# Altium schematic sheet main.SchDoc: Project SHED
size A4; DrawnBy: ultralyj; DocumentNumber: 1; Revision: 0.1; SheetNumber: 1; SheetTotal: 2
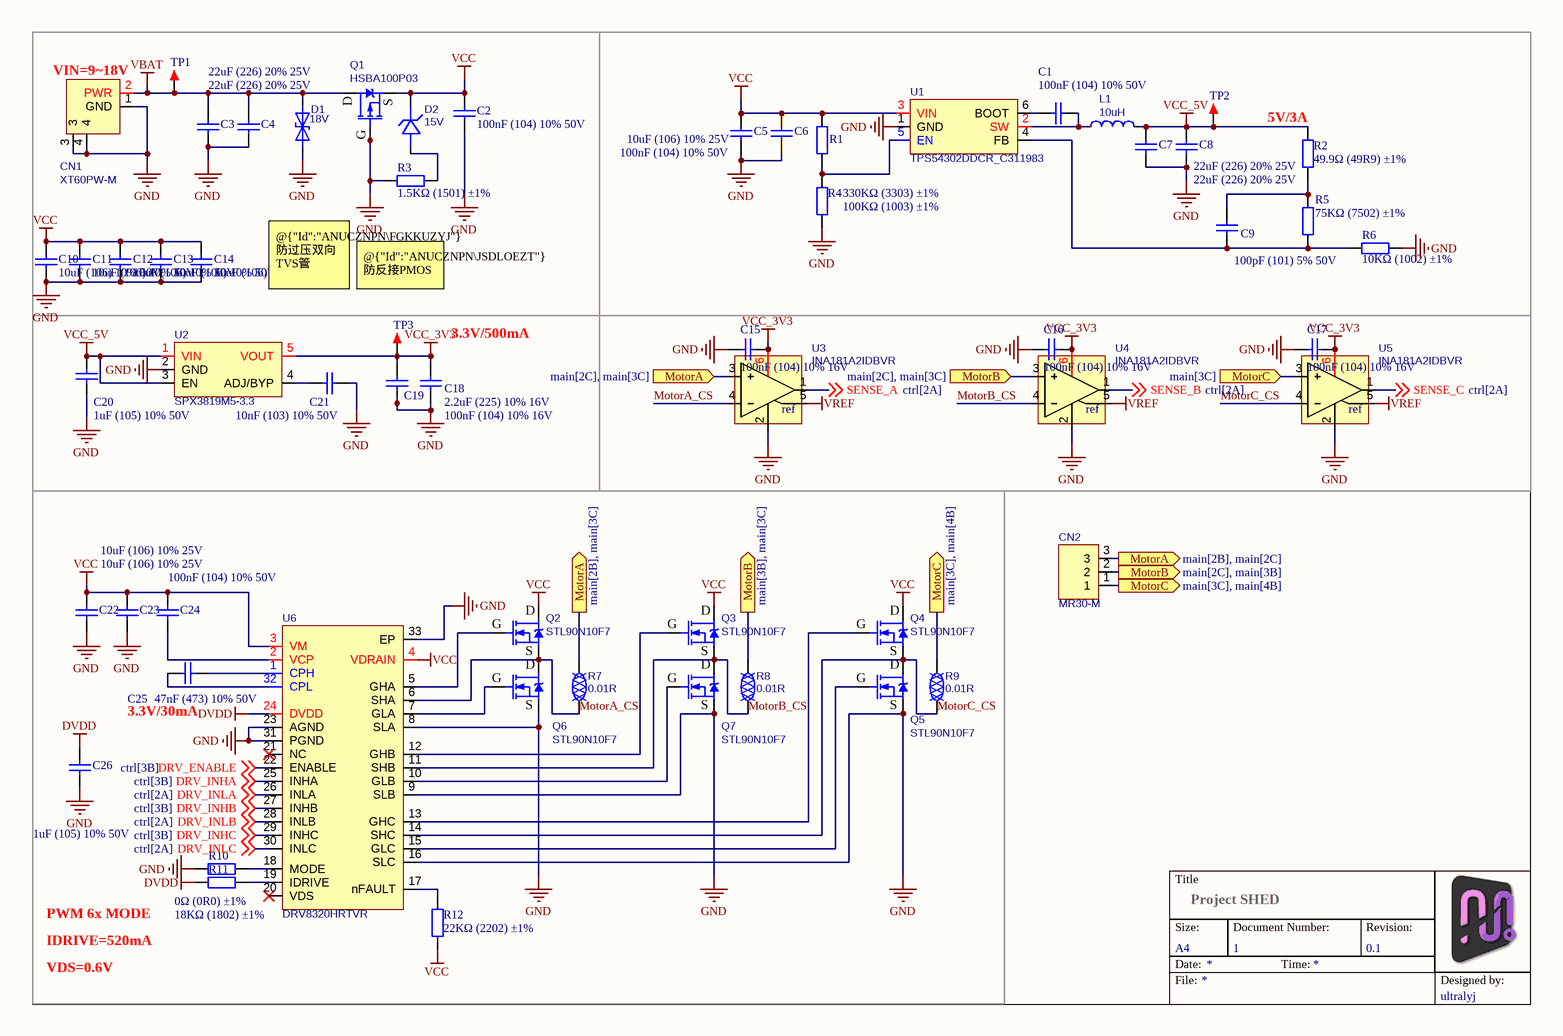
[diagram p0: main.SchDoc]

## Parts
C1  100nF (104) 10% 50V  [LC-0603_C_NOSILK]
C2  100nF (104) 10% 50V  [LC-0603_C_NOSILK]
C3  22uF (226) 20% 25V  [LC-0805_C_NOSILK]
C4  22uF (226) 20% 25V  [LC-0805_C_NOSILK]
C5  10uF (106) 10% 25V  [LC-0805_C_NOSILK]
C6  100nF (104) 10% 50V  [LC-0603_C_NOSILK]
C7  22uF (226) 20% 25V  [LC-0805_C_NOSILK]
C8  22uF (226) 20% 25V  [LC-0805_C_NOSILK]
C9  100pF (101) 5% 50V  [LC-0402_C_NOSILK]
C10  10uF (106) 10% 50V  [1206_C]
C11  10uF (106) 10% 50V  [1206_C]
C12  10uF (106) 10% 50V  [1206_C]
C13  10uF (106) 10% 50V  [1206_C]
C14  10uF (106) 10% 50V  [1206_C]
C15  100nF (104) 10% 16V  [LC-0402_C_NOSILK]
C16  100nF (104) 10% 16V  [LC-0402_C_NOSILK]
C17  100nF (104) 10% 16V  [LC-0402_C_NOSILK]
C18  2.2uF (225) 10% 16V  [LC-0603_C_NOSILK]
C19  100nF (104) 10% 16V  [LC-0402_C_NOSILK]
C20  1uF (105) 10% 50V  [LC-0603_C_NOSILK]
C21  10nF (103) 10% 50V  [LC-0402_C_NOSILK]
C22  10uF (106) 10% 25V  [LC-0805_C_NOSILK]
C23  10uF (106) 10% 25V  [LC-0805_C_NOSILK]
C24  100nF (104) 10% 50V  [LC-0603_C_NOSILK]
C25  47nF (473) 10% 50V  [LC-0603_C_NOSILK]
C26  1uF (105) 10% 50V  [LC-0603_C_NOSILK]
CN1  XT60PW-M  [CONN-TH_XT60PW-M]
CN2  MR30-M  [AMASS-MR30-M]
D1  18V  [SMB_L4.6-W3.6-LS5.3-BI]
D2  15V  [SOD-323_L1.8-W1.3-LS2.5-RD]
L1  10uH  [IND-SMD_L5.4-W5.2]
Q1  HSBA100P03  [DFN-8_L5.7-W5.1-P1.27-LS6.1-BL]
Q2  STL90N10F7  [POWERFLAT-8_L5.2-W6.0-P1.27-LS6.2-BL]
Q3  STL90N10F7  [POWERFLAT-8_L5.2-W6.0-P1.27-LS6.2-BL]
Q4  STL90N10F7  [POWERFLAT-8_L5.2-W6.0-P1.27-LS6.2-BL]
Q5  STL90N10F7  [POWERFLAT-8_L5.2-W6.0-P1.27-LS6.2-BL]
Q6  STL90N10F7  [POWERFLAT-8_L5.2-W6.0-P1.27-LS6.2-BL]
Q7  STL90N10F7  [POWERFLAT-8_L5.2-W6.0-P1.27-LS6.2-BL]
R1  330KΩ (3303) ±1%  [LC-0402_R_NOSILK]
R2  49.9Ω (49R9) ±1%  [LC-0402_R_NOSILK]
R3  1.5KΩ (1501) ±1%  [LC-0402_R_NOSILK]
R4  100KΩ (1003) ±1%  [LC-0402_R_NOSILK]
R5  75KΩ (7502) ±1%  [LC-0402_R_NOSILK]
R6  10KΩ (1002) ±1%  [LC-0402_R_NOSILK]
R7  0.01R  [RES-SMD_L6.4-W3.2_RLP25]
R8  0.01R  [RES-SMD_L6.4-W3.2_RLP25]
R9  0.01R  [RES-SMD_L6.4-W3.2_RLP25]
R10  0Ω (0R0) ±1%  [LC-0402_R_NOSILK]
R11  18KΩ (1802) ±1%  [LC-0402_R_NOSILK]
R12  22KΩ (2202) ±1%  [LC-0402_R_NOSILK]
TP1  TEST  [TEST 1.6]  (value not drawn)
TP2  TEST  [TEST 1.6]  (value not drawn)
TP3  TEST  [TEST 1.6]  (value not drawn)
U1  TPS54302DDCR_C311983  [SOT-23-6_L2.9-W1.6-P0.95-LS2.8-BL]
U2  SPX3819M5-3.3  [SOT-23-5_L2.9-W1.6-P0.95-LS2.8-BL]
U3  INA181A2IDBVR  [SOT-23-6_L2.9-W1.6-P0.95-LS2.8-BL]
U4  INA181A2IDBVR  [SOT-23-6_L2.9-W1.6-P0.95-LS2.8-BL]
U5  INA181A2IDBVR  [SOT-23-6_L2.9-W1.6-P0.95-LS2.8-BL]
U6  DRV8320HRTVR  [QFN-32_L5.0-W5.0-P0.50-TL-EP3.5]

## Blocks framed on the sheet
VIN=9~18V: C2-C4 C10-C14 CN1 D1 D2 Q1 R3 TP1
5V/3A: C1 C5-C9 L1 R1 R2 R4-R6 TP2 U1
3.3V/500mA: C18-C21 TP3 U2

## Ports
MotorA (in, see main[2C], main[3C]), MotorA (out, see main[2B], main[2C]), MotorA (out, see main[2B], main[3C]), MotorB (in, see main[2C], main[3C]), MotorB (out, see main[2C], main[3B]), MotorB (out, see main[3B], main[3C]), MotorC (in, see main[3C]), MotorC (out, see main[3C], main[4B])

## Nets
DVDD: C26.2 R11.1 U6.24(DVDD)
GND: C2.1 C3.1 C4.1 C5.1 C6.1 C7.1 C8.1 C10.1 C11.1 C12.1 C13.1 C14.1 C15.1 C16.1 C17.1 C18.1 C19.1 C20.1 C21.2 C22.1 C23.1 C26.1 CN1.1(GND) CN1.3 CN1.4 D1.1 Q1.4(G) Q5.1,2,3(S) Q6.1,2,3(S) Q7.1,2,3(S) R3.1 R4.1 R6.1 R10.1 U1.1(GND) U2.2(GND) U3.2(GND) U4.2(GND) U5.2(GND) U6.8(SLA) U6.9(SLB) U6.16(SLC) U6.23(AGND) U6.31(PGND) U6.33(EP)
VBAT: C3.2 C4.2 CN1.2(PWR) D1.2 Q1.5,6,7,8,9(D) TP1.1
VCC: C2.2 C5.2 C6.2 C10.2 C11.2 C12.2 C13.2 C14.2 C22.2 C23.2 C24.2 D2.1 Q1.1,2,3(S) Q2.5,6,7,8(D) Q3.5,6,7,8(D) Q4.5,6,7,8(D) R1.2 R12.2 U1.3(VIN) U6.3(VM) U6.4(VDRAIN)
VCC_3V3: C15.2 C16.2 C17.2 C18.2 C19.2 TP3.1 U2.5(VOUT) U3.6(VS) U4.6(VS) U5.6(VS)
VCC_5V: C7.2 C8.2 C20.2 L1.2 R2.2 TP2.1 U2.1(VIN) U2.3(EN)
VREF: U3.5(REF) U4.5(REF) U5.5(REF)
DRV_ENABLE: U6.22(ENABLE) ; off-sheet DRV_ENABLE
DRV_INHA: U6.25(INHA) ; off-sheet DRV_INHA
DRV_INHB: U6.27(INHB) ; off-sheet DRV_INHB
DRV_INHC: U6.29(INHC) ; off-sheet DRV_INHC
DRV_INLA: U6.26(INLA) ; off-sheet DRV_INLA
DRV_INLB: U6.28(INLB) ; off-sheet DRV_INLB
DRV_INLC: U6.30(INLC) ; off-sheet DRV_INLC
MotorA: CN2.3 R7.2 U3.3(IN+) ; port MotorA
MotorA_CS: Q2.1,2,3(S) Q6.5,6,7,8(D) R7.1 U3.4(IN-) U6.6(SHA)
MotorB: CN2.2 R8.2 U4.3(IN+) ; port MotorB
MotorB_CS: Q3.1,2,3(S) Q7.5,6,7,8(D) R8.1 U4.4(IN-) U6.11(SHB)
MotorC: CN2.1 R9.1 U5.3(IN+) ; port MotorC
MotorC_CS: Q4.1,2,3(S) Q5.5,6,7,8(D) R9.2 U5.4(IN-) U6.14(SHC)
SENSE_A: U3.1(OUT) ; off-sheet SENSE_A
SENSE_B: U4.1(OUT) ; off-sheet SENSE_B
SENSE_C: U5.1(OUT) ; off-sheet SENSE_C
NetC1_1: C1.1 U1.6(BOOT)
NetC1_2: C1.2 L1.1 U1.2(SW)
NetC9_1: C9.1 R5.1 R6.2 U1.4(FB)
NetC9_2: C9.2 R2.1 R5.2
NetC21_1: C21.1 U2.4(ADJ/BYP)
NetC24_1: C24.1 U6.2(VCP)
NetC25_1: C25.1 U6.32(CPL)
NetC25_2: C25.2 U6.1(CPH)
NetD2_2: D2.2 R3.2
NetQ2_4: Q2.4(G) U6.5(GHA)
NetQ3_4: Q3.4(G) U6.12(GHB)
NetQ4_4: Q4.4(G) U6.13(GHC)
NetQ5_4: Q5.4(G) U6.15(GLC)
NetQ6_4: Q6.4(G) U6.7(GLA)
NetQ7_4: Q7.4(G) U6.10(GLB)
NetR1_1: R1.1 R4.2 U1.5(EN)
NetR10_2: R10.2 U6.18(MODE)
NetR11_2: R11.2 U6.19(IDRIVE)
NetR12_1: R12.1 U6.17(nFAULT)

Not connected (* = marked no-connect by the designer): U6 20(VDS)* 21(NC)*

## Notes on the sheet
- @{"Id":"ANUCZNPN\FGKKUZYJ"} 防过压双向TVS管
- @{"Id":"ANUCZNPN\JSDLOEZT"} 防反接PMOS
- (near C25) 3.3V/30mA
- PWM 6x MODE
- IDRIVE=520mA
- VDS=0.6V
- Title
- Size:
- A4
- Date:
- File:
- Document Number:
- Time:
- Revision:
- Designed by:
- (in symbol INA181A2IDBVR) ref

## Library data of the parts
C1 C2 C6 C24 = 0603 100nF (104) 10% 50V: 贴片电容; ComponentLink1Description: 供应商链接; ComponentLink1URL: http://www.szlcsc.com/product/details_15331.html; Package: 0603; Supplier: LC; SuppliersPartNumber: C14663
C3 C4 C7 C8 = 0805 22uF (226) 20% 25V: 贴片电容; ComponentLink1Description: 供应商链接; ComponentLink1URL: http://www.szlcsc.com/product/details_46786.html; Package: 0805; Supplier: LC; SuppliersPartNumber: C45783
C5 C22 C23 = 0805 10uF (106) 10% 25V: 贴片电容; ComponentLink1Description: 供应商链接; ComponentLink1URL: http://www.szlcsc.com/product/details_16532.html; Package: 0805; Supplier: LC; SuppliersPartNumber: C15850
C9 = 0402 100pF (101) 5% 50V: 贴片电容; ComponentLink1Description: 供应商链接; ComponentLink1URL: http://www.szlcsc.com/product/details_1898.html; Package: 0402; Supplier: LC; SuppliersPartNumber: C1546
C10-C14 = 1206 10uF (106) 10% 50V: 贴片电容; ComponentLink1Description: 供应商链接; ComponentLink1URL: http://www.szlcsc.com/product/details_14236.html; Package: 1206; Supplier: LC; SuppliersPartNumber: C13585
C15-C17 C19 = 0402 100nF (104) 10% 16V: 贴片电容; ComponentLink1Description: 供应商链接; ComponentLink1URL: http://www.szlcsc.com/product/details_1877.html; Package: 0402; Supplier: LC; SuppliersPartNumber: C1525
C18 = 0603 2.2uF (225) 10% 16V: 贴片电容; ComponentLink1Description: 供应商链接; ComponentLink1URL: http://www.szlcsc.com/product/details_24366.html; Package: 0603; Supplier: LC; SuppliersPartNumber: C23630
C20 C26 = 0603 1uF (105) 10% 50V: 贴片电容; ComponentLink1Description: 供应商链接; ComponentLink1URL: http://www.szlcsc.com/product/details_16531.html; Package: 0603; Supplier: LC; SuppliersPartNumber: C15849
C21 = 0402 10nF (103) 10% 50V: 贴片电容; ComponentLink1Description: 供应商链接; ComponentLink1URL: http://www.szlcsc.com/product/details_15869.html; Package: 0402; Supplier: LC; SuppliersPartNumber: C15195
C25 = 0603 47nF (473) 10% 50V: 贴片电容; ComponentLink1Description: 供应商链接; ComponentLink1URL: http://www.szlcsc.com/product/details_1974.html; Package: 0603; Supplier: LC; SuppliersPartNumber: C1622
CN1 = XT60PW-M: 电源插座; BOM_Manufacturer: AMASS(艾迈斯); Contributor: LCSC; BOM_Supplier: LCSC; BOM_Supplier Part: C98732; BOM_Manufacturer Part: XT60PW-M; BOM_JLCPCB Part Class: Extended Part; spicePre: C; spiceSymbolName: XT60PW-M
CN2 = MR30-M: 三芯XT插头连接器Male; BOM_Manufacturer: AMASS(艾迈斯); Contributor: lcsc; BOM_Supplier: LCSC; BOM_Supplier Part: C99873; BOM_Manufacturer Part: MR30-M; link: https://atta.szlcsc.com/upload/public/pdf/source/20170412/1491969315720.pdf; BOM_JLCPCB Part Class: Extended Part; spicePre: U; spiceSymbolName: MR30-M
D1 = SMBJ18CA-C78413: 双向18V TVS管; BOM_Manufacturer Part: SMBJ18CA/TR13; BOM_Manufacturer: Brightking(君耀电子); BOM_Supplier: LCSC; BOM_Supplier Part: C78413; BOM_JLCPCB Part Class: Extended Part; spicePre: D; spiceSymbolName: SMBJ18CA-C78413
D2 = PTVSHC3D15VUH: 15V TVS管; BOM_Manufacturer: Prisemi(芯导); Contributor: LCSC; BOM_Supplier: LCSC; BOM_Supplier Part: C312234; BOM_Manufacturer Part: PTVSHC3D15VUH; BOM_JLCPCB Part Class: Extended Part; spicePre: D; spiceSymbolName: PTVSHC3D15VUH
L1 = 10uH: YSPI0530-100M 2.5A功率电感; BOM_Manufacturer: YJYCOIN(益嘉源); nameAlias: Inductance; Contributor: LCSC; BOM_Supplier: LCSC; BOM_Supplier Part: C351099; BOM_Manufacturer Part: YSPI0530-100M; BOM_JLCPCB Part Class: Extended Part; spicePre: L; spiceSymbolName: YSPI0530-100M
Q1 = HSBA100P03: P-Channel Mosfet Vdss=30V Id=100A; BOM_Manufacturer: HUASHUO(华朔); Contributor: LCSC; BOM_Supplier: LCSC; BOM_Supplier Part: C701057; BOM_Manufacturer Part: HSBA100P03; BOM_JLCPCB Part Class: Extended Part; spicePre: Q; spiceSymbolName: HSBA100P03
Q2-Q7 = STL90N10F7: N-Channel Mosfet Vdss=100V Id=70A; BOM_Manufacturer: ST(意法半导体); Contributor: LCSC; BOM_Supplier: LCSC; BOM_Supplier Part: C457493; BOM_Manufacturer Part: STL90N10F7; BOM_JLCPCB Part Class: Extended Part; spicePre: Q; spiceSymbolName: STL90N10F7
R1 = 0402 330KΩ (3303) 1%: 贴片电阻; ComponentLink1Description: 供应商链接; ComponentLink1URL: http://www.szlcsc.com/product/details_26521.html; Package: 0402; Supplier: LC; SuppliersPartNumber: C25778
R2 = 0402 49.9Ω (49R9) 1%: 贴片电阻; ComponentLink1Description: 供应商链接; ComponentLink1URL: http://www.szlcsc.com/product/details_25863.html; Package: 0402; Supplier: LC; SuppliersPartNumber: C25120
R3 = 0402 1.5KΩ (1501) 1%: 贴片电阻; ComponentLink1Description: 供应商链接; ComponentLink1URL: http://www.szlcsc.com/product/details_26610.html; Package: 0402; Supplier: LC; SuppliersPartNumber: C25867
R4 = 0402 100KΩ (1003) 1%: 贴片电阻; ComponentLink1Description: 供应商链接; ComponentLink1URL: http://www.szlcsc.com/product/details_26484.html; Package: 0402; Supplier: LC; SuppliersPartNumber: C25741
R5 = 0402 75KΩ (7502) 1%: 贴片电阻; ComponentLink1Description: 供应商链接; ComponentLink1URL: http://www.szlcsc.com/product/details_26541.html; Package: 0402; Supplier: LC; SuppliersPartNumber: C25798
R6 = 0402 10KΩ (1002) 1%: 贴片电阻; ComponentLink1Description: 供应商链接; ComponentLink1URL: http://www.szlcsc.com/product/details_26487.html; Package: 0402; Supplier: LC; SuppliersPartNumber: C25744
R7-R9 = PA2512FKF7T0R001E: 0.01欧姆采样电阻 3W; BOM_Manufacturer: YAGEO(国巨); Contributor: lcsc; BOM_Supplier: LCSC; BOM_Supplier Part: C723380; BOM_Manufacturer Part: PA2512FKF7T0R001E; Resistance: -; BOM_JLCPCB Part Class: Extended Part; spicePre: R; spiceSymbolName: PA2512FKF7T0R001E
R10 = 0402 0Ω (0R0) 1%: 贴片电阻; ComponentLink1Description: 供应商链接; ComponentLink1URL: http://www.szlcsc.com/product/details_17853.html; Package: 0402; Supplier: LC; SuppliersPartNumber: C17168
R11 = 0402 18KΩ (1802) 1%: 贴片电阻; ComponentLink1Description: 供应商链接; ComponentLink1URL: http://www.szlcsc.com/product/details_26505.html; Package: 0402; Supplier: LC; SuppliersPartNumber: C25762
R12 = 0402 22KΩ (2202) 1%: 贴片电阻; ComponentLink1Description: 供应商链接; ComponentLink1URL: http://www.szlcsc.com/product/details_26511.html; Package: 0402; Supplier: LC; SuppliersPartNumber: C25768
TP1-TP3 = TEST: 测试点; 版权归属: 源创客; BOM名称: 测试点; 学习资源: www.ooocke.com
U1 = TPS54302DDCR_C311983: DC-DC芯片 Vin=4.5V~28V Vout=596mV~28V Imax=3A; BOM_Manufacturer: TI(德州仪器); Contributor: LCSC; BOM_Supplier: LCSC; BOM_Supplier Part: C311983; BOM_Manufacturer Part: TPS54302DDCR; BOM_JLCPCB Part Class: Extended Part; spicePre: U; spiceSymbolName: TPS54302DDCR_C311983
U2 = SPX3819M5-3.3: Vin=16V Vout=3.3V 500mA LDO; BOM_Manufacturer: null; Contributor: lcsc; BOM_Supplier: LCSC; BOM_Supplier Part: C9900018941; BOM_Manufacturer Part: SPX3819M5-3.3; BOM_JLCPCB Part Class: Extended Part; spicePre: U; spiceSymbolName: SPX3819M5-3.3
U3-U5 = INA181A2IDBVR: 26V、双向、350kHz 电流感应放大器; BOM_Manufacturer: TI(德州仪器); Contributor: lcsc; BOM_Supplier: LCSC; BOM_Supplier Part: C2058784; BOM_Manufacturer Part: INA181A2IDBVR; BOM_JLCPCB Part Class: Extended Part; spicePre: U; spiceSymbolName: INA181A2IDBVR
U6 = DRV8320HRTVR: 最大 65V 三相智能栅极驱动器; BOM_Manufacturer: TI(德州仪器); Contributor: LCSC; BOM_Supplier: LCSC; BOM_Supplier Part: C701782; BOM_Manufacturer Part: DRV8320HRTVR; BOM_JLCPCB Part Class: Extended Part; spicePre: U; spiceSymbolName: DRV8320HRTVR